# EAGLE schematic Buck (EAGLE 9.6.2)
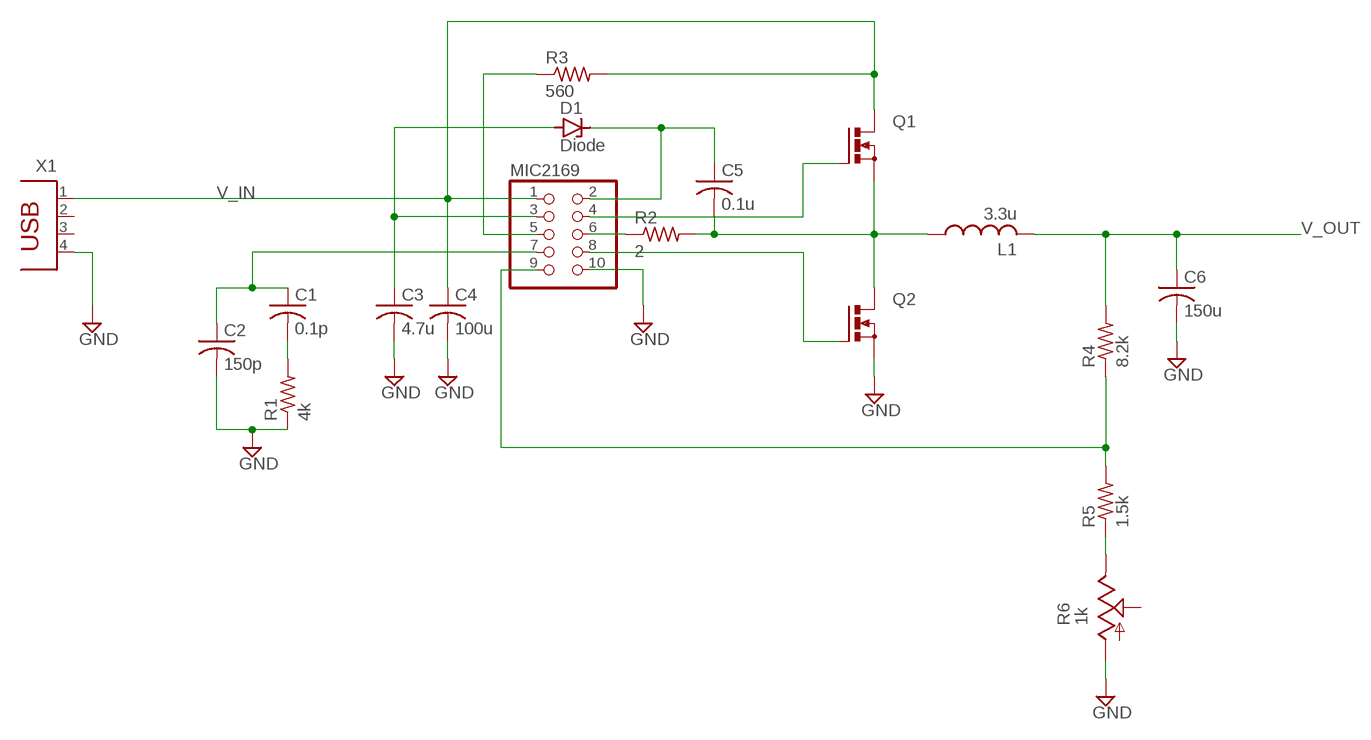
[diagram p0: schematic, sheet 1]

## Parts
C1  0.1p  C-USC0805  [C0805]
C2  150p  C-USC0805  [C0805]
C3  4.7u  C-USC0805  [C0805]
C4  100u  C-USC0805  [C0805]
C5  0.1u  C-USC0805  [C0805]
C6  150u  C-USC0805  [C0805]
D1  Diode  1N821  [DO35Z10]
L1  3.3u  L-USL2825P  [L2825P]
MIC2169  PINHD-2X5  [2X05]
R1  4k  R-US_R0805  [R0805]
R2  2  R-US_R0805  [R0805]
R3  560  R-US_R0805  [R0805]
R4  8.2k  R-US_R0805  [R0805]
R5  1.5k  R-US_R0805  [R0805]
R6  1k  TRIM_US-3223G  [3223G]
X1  PN61729  [PN61729]

## Nets
GND: C2.2 C3.2 C4.2 C6.2 MIC2169.10 R1.1 R6.1(A) X1.4
N$2: C5.1 D1.C MIC2169.2
N$3: C3.1 D1.A MIC2169.3
N$4: C5.2 L1.1 R2.2
N$6: MIC2169.6 R2.1
N$7: MIC2169.4
N$8: MIC2169.8
N$9: C1.2 R1.2
N$10: MIC2169.5 R3.1
N$11: MIC2169.9 R4.1 R5.2
N$12: C1.1 C2.1 MIC2169.7
N$13: R5.1 R6.3(E)
V_IN: C4.1 MIC2169.1 R3.2 X1.1
V_OUT: C6.1 L1.2 R4.2
Unconnected: R6.2(S) X1.2 X1.3

## Library data of the parts
C1-C6 = rcl:C-US: CAPACITOR, American symbol; SPICEPREFIX: C
D1 = diode:1N821: Reference DIODE temperature compensated, 6,2 V
L1 = rcl:L-US: INDUCTOR, American symbol; SPICEPREFIX: L
MIC2169 = pinhead:PINHD-2X5: PIN HEADER
R1-R5 = rcl:R-US_: RESISTOR, American symbol; SPICEPREFIX: R
R6 = pot:TRIM_US-: POTENTIOMETER
X1 = con-berg:PN61729: BERG USB connector; OC_FARNELL: unknown; OC_NEWARK: unknown